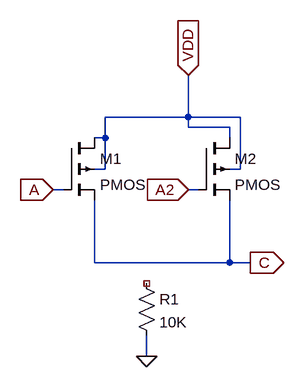
[diagram p0: schematic nand.asc]
nand.asc, the LTspice schematic file:
Version 4
SHEET 1 880 680
WIRE 256 80 256 16
WIRE 256 80 128 80
WIRE 336 80 256 80
WIRE 256 96 256 80
WIRE 320 96 256 96
WIRE 128 112 128 80
WIRE 128 112 112 112
WIRE 320 112 320 96
WIRE 128 160 128 112
WIRE 128 160 112 160
WIRE 336 160 336 80
WIRE 336 160 320 160
WIRE 64 192 48 192
WIRE 272 192 256 192
WIRE 112 304 112 208
WIRE 320 304 112 304
WIRE 320 304 320 208
WIRE 352 304 320 304
WIRE 192 448 192 416
FLAG 48 192 A
IOPIN 48 192 In
FLAG 256 192 A2
IOPIN 256 192 In
FLAG 192 448 0
FLAG 352 304 C
IOPIN 352 304 Out
FLAG 256 16 VDD
IOPIN 256 16 In
SYMBOL pmos4 64 112 R0
SYMATTR InstName M1
SYMBOL pmos4 272 112 R0
SYMATTR InstName M2
SYMBOL res 176 320 R0
SYMATTR InstName R1
SYMATTR Value 10K

The netlist it stands for:
* nand.asc
M1 VDD A C VDD PMOS
M2 VDD A2 C VDD PMOS
R1 NC_01 0 10K
.model NMOS NMOS
.model PMOS PMOS
.lib standard.mos
.backanno
.end